# Altium schematic sheet Sensing - Voltage.SchDoc: [8] Sensing - Voltage
size A4; ApprovedBy: Nagy Richard; CheckedBy: Nagy Richard; Author: Nagy Richard; CompanyName: EmbedCore; DrawnBy: Nagy Richard; Engineer: Nagy Richard; Organization: EmbedCore; DocumentNumber: 8; Revision: 1.0; SheetNumber: 8; SheetTotal: 8
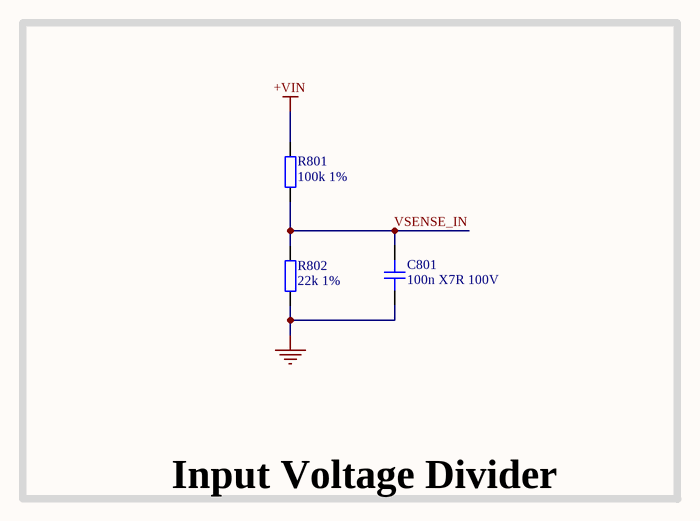
[diagram p0: Sensing - Voltage.SchDoc]

## Parts
C801  100n X7R 100V  [CAP_0603]
R801  100k 1%  [RES_0603]
R802  22k 1%  [RES_0603]

## Blocks framed on the sheet
Input Voltage Divider: C801 R801 R802

## Nets
+VIN: R801.2
GND: C801.1 R802.1
VSENSE_IN: C801.2 R801.1 R802.2

## Notes on the sheet
- Title:
- Drawn By:
- Page Contents:
- Checked By:
- Size:
- Date:
- File:
- License:
- Email:
- A4
- Number:
- Time:
- Revision:
- Sheet
- Website:
- of

## Library data of the parts
C801 = CAP_0603: Capacitor SMD 0603; Manufacturer: CCTC; Manufacturer Part Number: TCC0603X7R104K101CT; Distributor Link: www.lcsc.com; LCSC: C696916; Rating: *; Dielectric: *
R801 = RES_0603: Resistor SMD 0603; Manufacturer: Vishay Intertech; Manufacturer Part Number: MCT06030C1003FP500; Distributor Link: www.lcsc.com; LCSC: C161805
R802 = RES_0603: Resistor SMD 0603; Manufacturer: Vishay Intertech; Manufacturer Part Number: CRCW060322K0FKEA; Distributor Link: www.lcsc.com; LCSC: C844758